# Altium project EVB_FET1052_C.PrjPcb
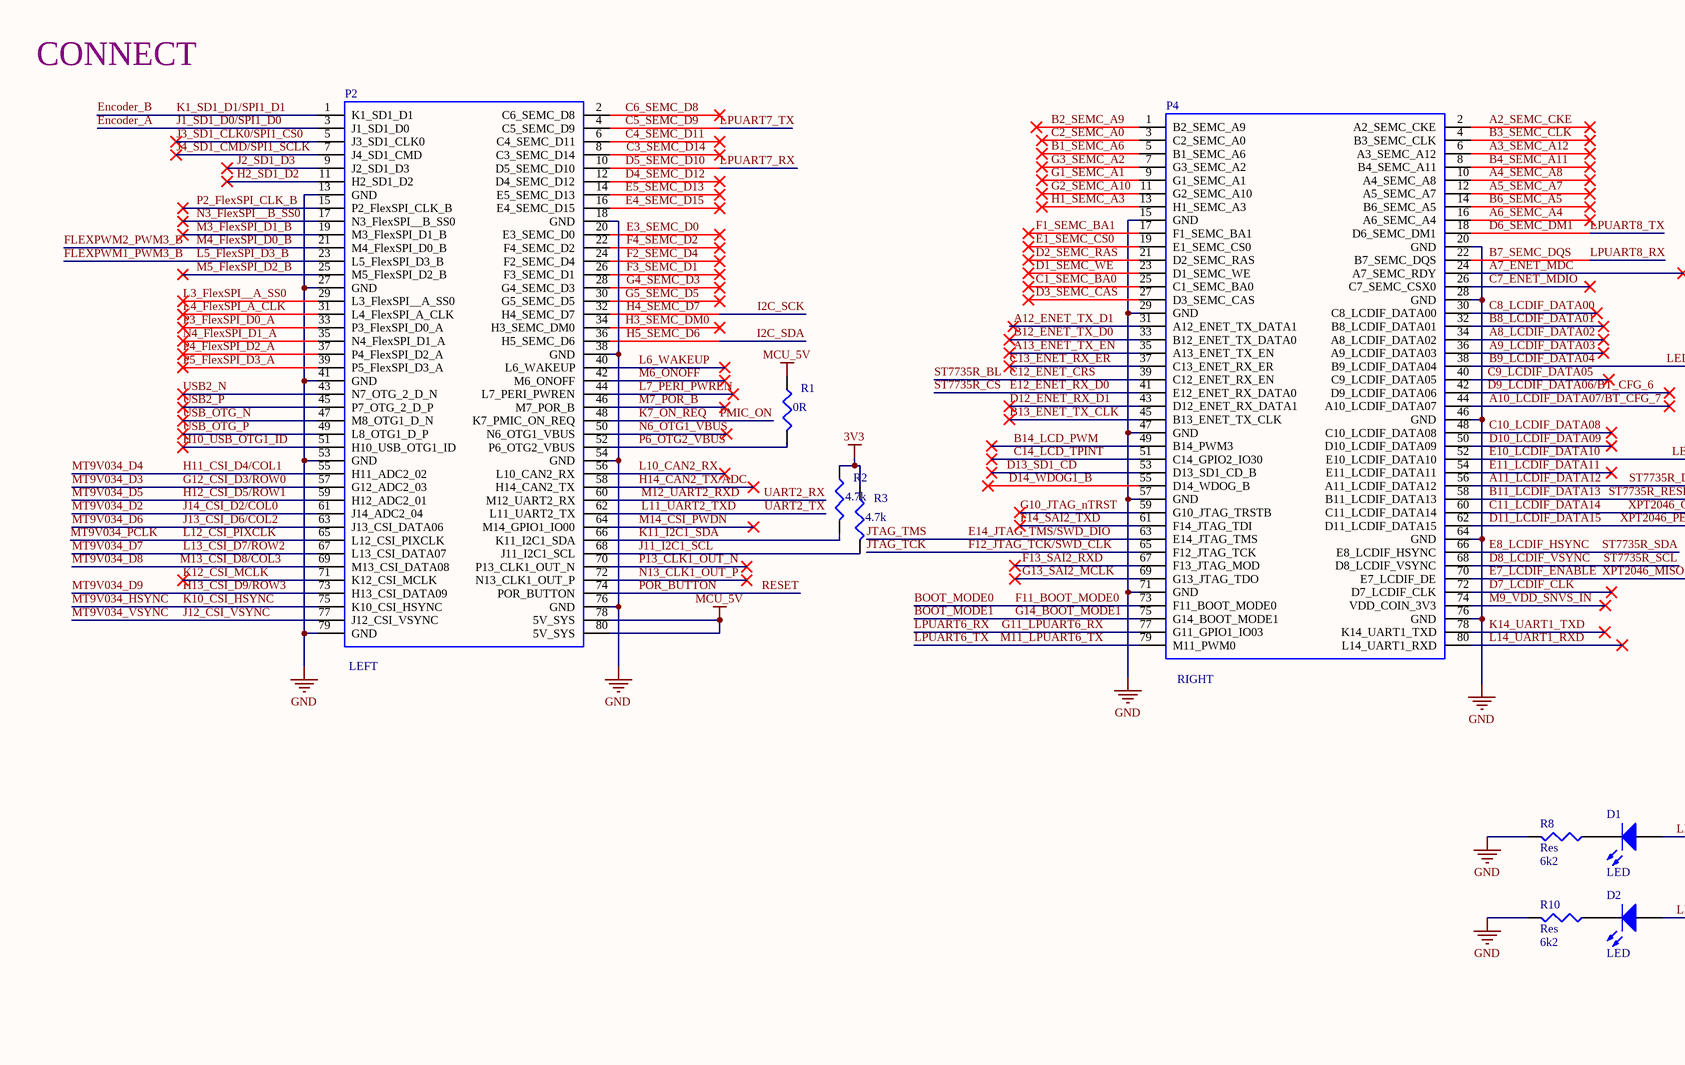
[diagram p0: EVB1.SchDoc, left]
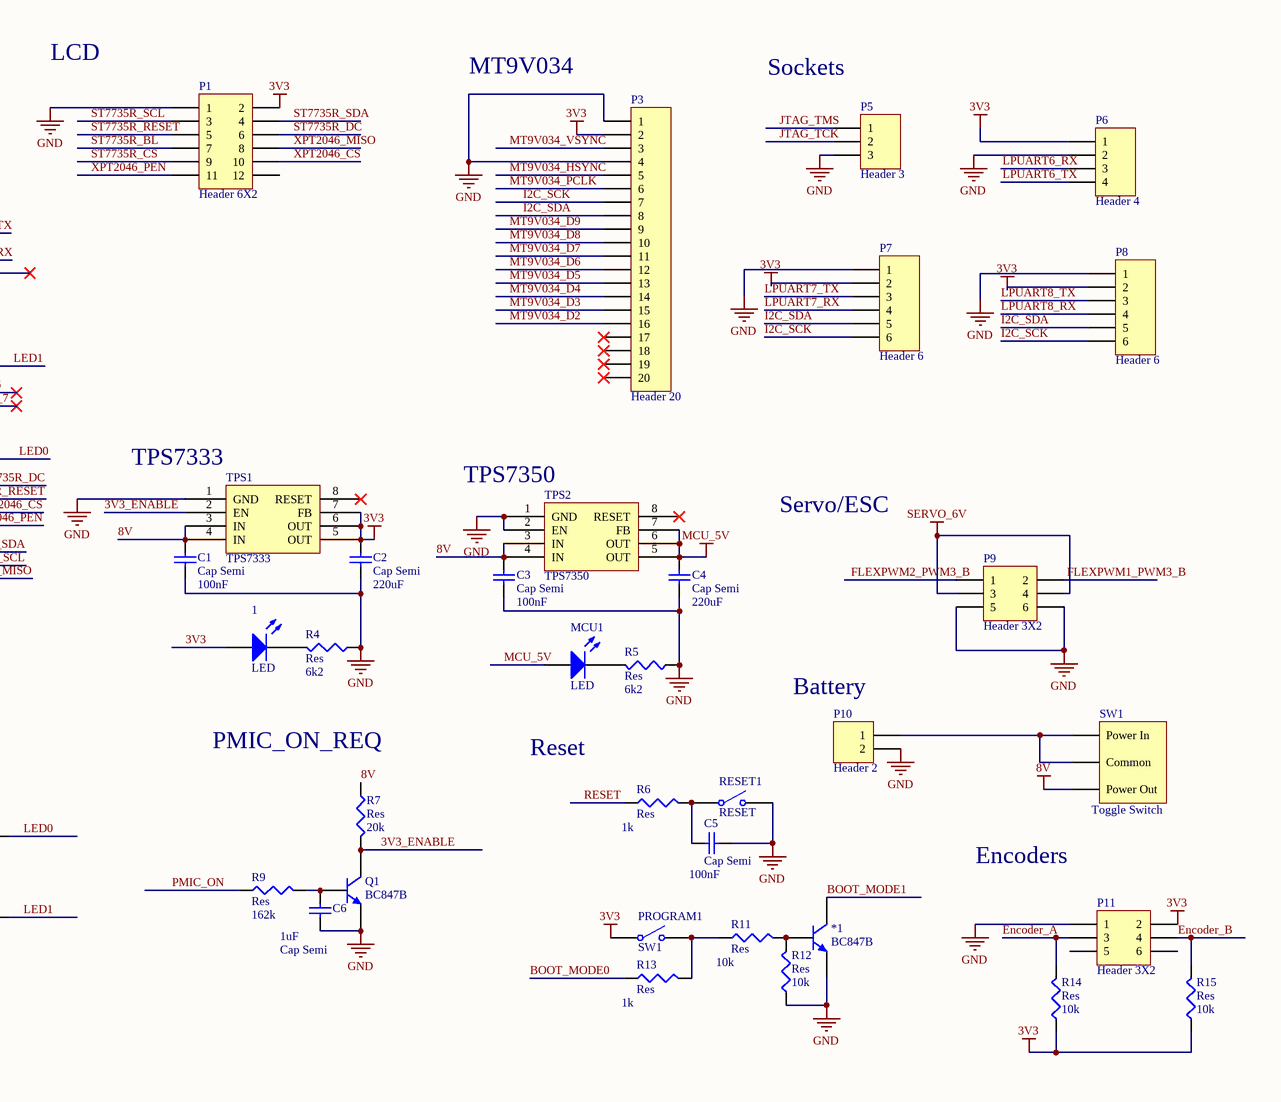
[diagram p1: EVB1.SchDoc, right]
1 sheet, 43 parts. Net scope: global (net labels, ports and power ports of the same name join across sheets).
Board file: v1.4.PcbDoc

## Sheet EVB1.SchDoc
size A2

### Parts
1  LED  [LED 0805]
*1  BC847B  [SOT-23]
C1  Cap Semi  value 100nF  [CC2012-0805]
C2  Cap Semi  value 220uF  [CC3216-1206]
C3  Cap Semi  value 100nF  [CC2012-0805]
C4  Cap Semi  value 220uF  [CC3216-1206]
C5  Cap Semi  value 100nF  [CC2012-0805]
C6  Cap Semi  value 1uF  [CC2012-0805]
D1  LED  [LED 0805]
D2  LED  [LED 0805]
MCU1  LED  [LED 0805]
P1  Header 6X2  [HDR2X6]
P2  LEFT  [CON80]
P3  Header 20  [FPC0.5_20P]
P4  RIGHT  [CON80]
P5  Header 3  [HDR1X3]
P6  Header 4  [HDR1X4]
P7  Header 6  [HDR1X6]
P8  Header 6  [HDR1X6]
P9  Header 3X2  [HDR2X3]
P10  Header 2  [XT30PW-M]
P11  Header 3X2  [SMMD HEADER 2X3]
PROGRAM1  SW1  [PUSHBUTTOM]
Q1  BC847B  [SOT-23]
R1  0R  [CR2012-0805]
R2  4.7k  [CR2012-0805]
R3  4.7k  [CR2012-0805]
R4  Res  value 6k2  [CR2012-0805]
R5  Res  value 6k2  [CR2012-0805]
R6  Res  value 1k  [CR2012-0805]
R7  Res  value 20k  [CR2012-0805]
R8  Res  value 6k2  [CR2012-0805]
R9  Res  value 162k  [CR2012-0805]
R10  Res  value 6k2  [CR2012-0805]
R11  Res  value 10k  [CR2012-0805]
R12  Res  value 10k  [CR2012-0805]
R13  Res  value 1k  [CR2012-0805]
R14  Res  value 10k  [CR2012-0805]
R15  Res  value 10k  [CR2012-0805]
RESET1  RESET  [PUSHBUTTOM]
SW1  Toggle Switch  [ToggleSwitch]
TPS1  TPS7333  [TPS7333]
TPS2  TPS7350  [TPS7333]

### Nets
3V3: 1.1(A) C2.2 P1.2 P3.2 P6.1 P7.2 P8.2 P11.2 PROGRAM1.1(COMMON) R2.1 R3.1 R14.1 R15.1 TPS1.5(OUT) TPS1.6(OUT) TPS1.7(FB)
8V: C1.2 C3.2 R7.1 SW1.1(Power_Out) TPS1.3(IN) TPS1.4(IN) TPS2.3(IN) TPS2.4(IN)
GND: *1.2(E) C1.1 C2.1 C3.1 C4.1 C5.2 C6.1 P1.1 P2.13(GND) P2.18(GND) P2.27(GND) P2.38(GND) P2.41(GND) P2.53(GND) P2.54(GND) P2.76(GND) P2.79(GND) P3.1 P3.4 P4.15(GND) P4.20(GND) P4.28(GND) P4.29(GND) P4.46(GND) P4.47(GND) P4.57(GND) P4.64(GND) P4.71(GND) P4.76(GND) P5.3 P6.2 P7.1 P8.1 P9.5 P9.6 P10.2 P11.1 Q1.2(E) R4.1 R5.1 R8.2 R10.2 R12.1 RESET1.2(NO) TPS1.1(GND) TPS2.1(GND) TPS2.2(EN)
MCU_5V: C4.2 MCU1.1(A) P2.78(5V_SYS) P2.80(5V_SYS) R1.1 TPS2.5(OUT) TPS2.6(OUT) TPS2.7(FB)
SERVO_6V: P9.3 P9.4
3V3_ENABLE: Q1.3(C) R7.2 TPS1.2(EN)
A2_SEMC_CKE: P4.2(A2_SEMC_CKE)
A3_SEMC_A12: P4.6(A3_SEMC_A12)
A4_SEMC_A8: P4.10(A4_SEMC_A8)
A5_SEMC_A7: P4.12(A5_SEMC_A7)
A6_SEMC_A4: P4.16(A6_SEMC_A4)
A7_ENET_MDC: P4.24(A7_SEMC_RDY)
A8_LCDIF_DATA02: P4.34(A8_LCDIF_DATA02)
A9_LCDIF_DATA03: P4.36(A9_LCDIF_DATA03)
A10_LCDIF_DATA07/BT_CFG_7: P4.44(A10_LCDIF_DATA07)
A11_LCDIF_DATA12: P1.6 P4.56(A11_LCDIF_DATA12)  [also labelled ST7735R_DC]
A12_ENET_TX_D1: P4.31(A12_ENET_TX_DATA1)
A13_ENET_TX_EN: P4.35(A13_ENET_TX_EN)
B1_SEMC_A6: P4.5(B1_SEMC_A6)
B2_SEMC_A9: P4.1(B2_SEMC_A9)
B3_SEMC_CLK: P4.4(B3_SEMC_CLK)
B4_SEMC_A11: P4.8(B4_SEMC_A11)
B6_SEMC_A5: P4.14(B6_SEMC_A5)
B7_SEMC_DQS: P4.22(B7_SEMC_DQS) P8.4  [also labelled LPUART8_RX]
B8_LCDIF_DATA01: P4.32(B8_LCDIF_DATA01)
B9_LCDIF_DATA04: D2.1(A) P4.38(B9_LCDIF_DATA04)  [also labelled LED1]
B11_LCDIF_DATA13: P1.5 P4.58(B11_LCDIF_DATA13)  [also labelled ST7735R_RESET]
B12_ENET_TX_D0: P4.33(B12_ENET_TX_DATA0)
B13_ENET_TX_CLK: P4.45(B13_ENET_TX_CLK)
B14_LCD_PWM: P4.49(B14_PWM3)
BOOT_MODE0: P4.73(F11_BOOT_MODE0) R13.1  [also labelled F11_BOOT_MODE0]
BOOT_MODE1: *1.3(C) P4.75(G14_BOOT_MODE1)  [also labelled G14_BOOT_MODE1]
C1_SEMC_BA0: P4.25(C1_SEMC_BA0)
C2_SEMC_A0: P4.3(C2_SEMC_A0)
C3_SEMC_D14: P2.8(C3_SEMC_D14)
C4_SEMC_D11: P2.6(C4_SEMC_D11)
C5_SEMC_D9: P2.4(C5_SEMC_D9) P7.3  [also labelled LPUART7_TX]
C6_SEMC_D8: P2.2(C6_SEMC_D8)
C7_ENET_MDIO: P4.26(C7_SEMC_CSX0)
C8_LCDIF_DATA00: P4.30(C8_LCDIF_DATA00)
C9_LCDIF_DATA05: P4.40(C9_LCDIF_DATA05)
C10_LCDIF_DATA08: P4.48(C10_LCDIF_DATA08)
C11_LCDIF_DATA14: P1.10 P4.60(C11_LCDIF_DATA14)  [also labelled XPT2046_CS]
C12_ENET_CRS: P1.7 P4.39(C12_ENET_RX_EN)  [also labelled ST7735R_BL]
C13_ENET_RX_ER: P4.37(C13_ENET_RX_ER)
C14_LCD_TPINT: P4.51(C14_GPIO2_IO30)
D1_SEMC_WE: P4.23(D1_SEMC_WE)
D2_SEMC_RAS: P4.21(D2_SEMC_RAS)
D3_SEMC_CAS: P4.27(D3_SEMC_CAS)
D4_SEMC_D12: P2.12(D4_SEMC_D12)
D5_SEMC_D10: P2.10(D5_SEMC_D10) P7.4  [also labelled LPUART7_RX]
D6_SEMC_DM1: P4.18(D6_SEMC_DM1) P8.3  [also labelled LPUART8_TX]
D7_LCDIF_CLK: P4.72(D7_LCDIF_CLK)
D8_LCDIF_VSYNC: P1.3 P4.68(D8_LCDIF_VSYNC)  [also labelled ST7735R_SCL]
D9_LCDIF_DATA06/BT_CFG_6: P4.42(D9_LCDIF_DATA06)
D10_LCDIF_DATA09: P4.50(D10_LCDIF_DATA09)
D11_LCDIF_DATA15: P1.11 P4.62(D11_LCDIF_DATA15)  [also labelled XPT2046_PEN]
D12_ENET_RX_D1: P4.43(D12_ENET_RX_DATA1)
D13_SD1_CD: P4.53(D13_SD1_CD_B)
D14_WDOG1_B: P4.55(D14_WDOG_B)
E1_SEMC_CS0: P4.19(E1_SEMC_CS0)
E3_SEMC_D0: P2.20(E3_SEMC_D0)
E4_SEMC_D15: P2.16(E4_SEMC_D15)
E5_SEMC_D13: P2.14(E5_SEMC_D13)
E7_LCDIF_ENABLE: P1.8 P4.70(E7_LCDIF_DE)  [also labelled XPT2046_MISO]
E8_LCDIF_HSYNC: P1.4 P4.66(E8_LCDIF_HSYNC)  [also labelled ST7735R_SDA]
E10_LCDIF_DATA10: D1.1(A) P4.52(E10_LCDIF_DATA10)  [also labelled LED0]
E11_LCDIF_DATA11: P4.54(E11_LCDIF_DATA11)
E12_ENET_RX_D0: P1.9 P4.41(E12_ENET_RX_DATA0)  [also labelled ST7735R_CS]
E14_JTAG_TMS/SWD_DIO: P4.63(E14_JTAG_TMS) P5.1  [also labelled JTAG_TMS]
Encoder_A: P2.3(J1_SD1_D0) P11.3 R14.2  [also labelled J1_SD1_D0/SPI1_D0]
Encoder_B: P2.1(K1_SD1_D1) P11.4 R15.2  [also labelled K1_SD1_D1/SPI1_D1]
F1_SEMC_BA1: P4.17(F1_SEMC_BA1)
F2_SEMC_D4: P2.24(F2_SEMC_D4)
F3_SEMC_D1: P2.26(F3_SEMC_D1)
F4_SEMC_D2: P2.22(F4_SEMC_D2)
F12_JTAG_TCK/SWD_CLK: P4.65(F12_JTAG_TCK) P5.2  [also labelled JTAG_TCK]
F13_SAI2_RXD: P4.67(F13_JTAG_MOD)
F14_SAI2_TXD: P4.61(F14_JTAG_TDI)
FLEXPWM1_PWM3_B: P2.23(L5_FlexSPI_D3_B) P9.2  [also labelled L5_FlexSPI_D3_B]
FLEXPWM2_PWM3_B: P2.21(M4_FlexSPI_D0_B) P9.1  [also labelled M4_FlexSPI_D0_B]
G1_SEMC_A1: P4.9(G1_SEMC_A1)
G2_SEMC_A10: P4.11(G2_SEMC_A10)
G3_SEMC_A2: P4.7(G3_SEMC_A2)
G4_SEMC_D3: P2.28(G4_SEMC_D3)
G5_SEMC_D5: P2.30(G5_SEMC_D5)
G10_JTAG_nTRST: P4.59(G10_JTAG_TRSTB)
G11_LPUART6_RX: P4.77(G11_GPIO1_IO03) P6.3  [also labelled LPUART6_RX]
G12_CSI_D3/ROW0: P2.57(G12_ADC2_03) P3.15  [also labelled MT9V034_D3]
G13_SAI2_MCLK: P4.69(G13_JTAG_TDO)
H1_SEMC_A3: P4.13(H1_SEMC_A3)
H2_SD1_D2: P2.11(H2_SD1_D2)
H3_SEMC_DM0: P2.34(H3_SEMC_DM0)
H4_SEMC_D7: P2.32(H4_SEMC_D7) P3.7 P7.6 P8.6  [also labelled I2C_SCK]
H5_SEMC_D6: P2.36(H5_SEMC_D6) P3.8 P7.5 P8.5  [also labelled I2C_SDA]
H10_USB_OTG1_ID: P2.51(H10_USB_OTG1_ID)
H11_CSI_D4/COL1: P2.55(H11_ADC2_02) P3.14  [also labelled MT9V034_D4]
H12_CSI_D5/ROW1: P2.59(H12_ADC2_01) P3.13  [also labelled MT9V034_D5]
H13_CSI_D9/ROW3: P2.73(H13_CSI_DATA09) P3.9  [also labelled MT9V034_D9]
H14_CAN2_TX/ADC: P2.58(H14_CAN2_TX)
J2_SD1_D3: P2.9(J2_SD1_D3)
J3_SD1_CLK0/SPI1_CS0: P2.5(J3_SD1_CLK0)
J4_SD1_CMD/SPI1_SCLK: P2.7(J4_SD1_CMD)
J11_I2C1_SCL: P2.68(J11_I2C1_SCL) R3.2
J12_CSI_VSYNC: P2.77(J12_CSI_VSYNC) P3.3  [also labelled MT9V034_VSYNC]
J13_CSI_D6/COL2: P2.63(J13_CSI_DATA06) P3.12  [also labelled MT9V034_D6]
J14_CSI_D2/COL0: P2.61(J14_ADC2_04) P3.16  [also labelled MT9V034_D2]
K7_ON_REQ: P2.48(K7_PMIC_ON_REQ) R9.1  [also labelled PMIC_ON]
K10_CSI_HSYNC: P2.75(K10_CSI_HSYNC) P3.5  [also labelled MT9V034_HSYNC]
K11_I2C1_SDA: P2.66(K11_I2C1_SDA) R2.2
K12_CSI_MCLK: P2.71(K12_CSI_MCLK)
K14_UART1_TXD: P4.78(K14_UART1_TXD)
L3_FlexSPI__A_SS0: P2.29(L3_FlexSPI__A_SS0)
L4_FlexSPI_A_CLK: P2.31(L4_FlexSPI_A_CLK)
L6_WAKEUP: P2.40(L6_WAKEUP)
L7_PERI_PWREN: P2.44(L7_PERI_PWREN)
L10_CAN2_RX: P2.56(L10_CAN2_RX)
L11_UART2_TXD: P2.62(L11_UART2_TX)  [also labelled UART2_TX]
L12_CSI_PIXCLK: P2.65(L12_CSI_PIXCLK) P3.6  [also labelled MT9V034_PCLK]
L13_CSI_D7/ROW2: P2.67(L13_CSI_DATA07) P3.11  [also labelled MT9V034_D7]
L14_UART1_RXD: P4.80(L14_UART1_RXD)
LPUART6_TX: P4.79(M11_PWM0) P6.4  [also labelled M11_LPUART6_TX]
M3_FlexSPI_D1_B: P2.19(M3_FlexSPI_D1_B)
M5_FlexSPI_D2_B: P2.25(M5_FlexSPI_D2_B)
M6_ONOFF: P2.42(M6_ONOFF)
M7_POR_B: P2.46(M7_POR_B)
M9_VDD_SNVS_IN: P4.74(VDD_COIN_3V3)
M12_UART2_RXD: P2.60(M12_UART2_RX)  [also labelled UART2_RX]
M13_CSI_D8/COL3: P2.69(M13_CSI_DATA08) P3.10  [also labelled MT9V034_D8]
M14_CSI_PWDN: P2.64(M14_GPIO1_IO00)
N3_FlexSPI__B_SS0: P2.17(N3_FlexSPI__B_SS0)
N4_FlexSPI_D1_A: P2.35(N4_FlexSPI_D1_A)
N6_OTG1_VBUS: P2.50(N6_OTG1_VBUS)
N13_CLK1_OUT_P: P2.72(N13_CLK1_OUT_P)
P2_FlexSPI_CLK_B: P2.15(P2_FlexSPI_CLK_B)
P3_FlexSPI_D0_A: P2.33(P3_FlexSPI_D0_A)
P4_FlexSPI_D2_A: P2.37(P4_FlexSPI_D2_A)
P5_FlexSPI_D3_A: P2.39(P5_FlexSPI_D3_A)
P6_OTG2_VBUS: P2.52(P6_OTG2_VBUS) R1.2
P13_CLK1_OUT_N: P2.70(P13_CLK1_OUT_N)
POR_BUTTON: P2.74(POR_BUTTON) R6.1  [also labelled RESET]
USB2_N: P2.43(N7_OTG_2_D_N)
USB2_P: P2.45(P7_OTG_2_D_P)
USB_OTG_N: P2.47(M8_OTG1_D_N)
USB_OTG_P: P2.49(L8_OTG1_D_P)
Net1_2: 1.2(K) R4.2
Net*1_1: *1.1(B) R11.2 R12.2
NetC5_1: C5.1 R6.2 RESET1.1(COMMON)
NetC6_2: C6.2 Q1.1(B) R9.2
NetD1_2: D1.2(K) R8.1
NetD2_2: D2.2(K) R10.1
NetMCU1_2: MCU1.2(K) R5.2
NetP10_1: P10.1 SW1.2(Common) SW1.3(Power_In)
NetPROGRAM1_2: PROGRAM1.2(NO) R11.1 R13.2

Not connected (* = marked no-connect by the designer): P1 12; P3 17* 18* 19* 20*; P11 5 6; TPS1 8(RESET)*; TPS2 8(RESET)*

### Notes on the sheet
- CONNECT
- LCD
- MT9V034
- (near P5) Sockets
- (near TPS1) TPS7333
- (near TPS2) TPS7350
- Servo/ESC
- (near P10) Battery
- (near R7) PMIC_ON_REQ
- Reset
- Encoders
- Title
- Size:
- Date:
- File:
- A2
- Number:
- Time:
- Revision:
- Sheet
- of

### Library data of the parts
1 D1 D2 MCU1 = LED: Typical GaAs LED; Published: 8-Jun-2000; LatestRevisionDate: 08-Jul-2005; LatestRevisionNote: Mech Layer 1 removed.; PackageReference: LED-1; Publisher: Altium Limited
*1 Q1 = BC847B: NPN
C1-C6 = Cap Semi: Capacitor (Semiconductor SIM Model); Published: 8-Jun-2000; LatestRevisionDate: 17-Jul-2002; LatestRevisionNote: Re-released for DXP Platform.; PackageReference: C1206; Publisher: Altium Limited
P1 = Header 6X2: Header, 6-Pin, Dual row; LatestRevisionDate: 17-Jul-2002; LatestRevisionNote: Re-released for DXP Platform.; Publisher: Altium Limited
P2 = Header40X2_left: Header, 30-Pin, Dual row; LatestRevisionDate: 17-Jul-2002; LatestRevisionNote: Re-released for DXP Platform.; Publisher: Altium Limited
P3 = Header 20: Header, 20-Pin; LatestRevisionDate: 17-Jul-2002; LatestRevisionNote: Re-released for DXP Platform.; Publisher: Altium Limited
P4 = Header40X2_right: Header, 30-Pin, Dual row; LatestRevisionDate: 17-Jul-2002; LatestRevisionNote: Re-released for DXP Platform.; Publisher: Altium Limited
P5 = Header 3: Header, 3-Pin; LatestRevisionDate: 17-Jul-2002; LatestRevisionNote: Re-released for DXP Platform.; Publisher: Altium Limited
P6 = Header 4: Header, 4-Pin; LatestRevisionDate: 17-Jul-2002; LatestRevisionNote: Re-released for DXP Platform.; Publisher: Altium Limited
P7 P8 = Header 6: Header, 6-Pin; LatestRevisionDate: 17-Jul-2002; LatestRevisionNote: Re-released for DXP Platform.; Publisher: Altium Limited
P9 P11 = Header 3X2: Header, 3-Pin, Dual row; LatestRevisionDate: 17-Jul-2002; LatestRevisionNote: Re-released for DXP Platform.; Publisher: Altium Limited
P10 = Header 2: Header, 2-Pin; LatestRevisionDate: 17-Jul-2002; LatestRevisionNote: Re-released for DXP Platform.; Publisher: Altium Limited
PROGRAM1 RESET1 = SW-SPST: Single-Pole, Single-Throw Switch; Published: 24-Mar-1999; Revision: July-2002: Re-released for DXP Platform.; Publisher: Altium Limited
R1-R15 = Res: Resistor; Published: 8-Jun-2000; LatestRevisionDate: 4-Mar-2005; LatestRevisionNote: PCB Footprint replaced.; Publisher: Altium Limited
SW1 = ToggleSwitch: Power toggle switch
TPS2 = TPS7333